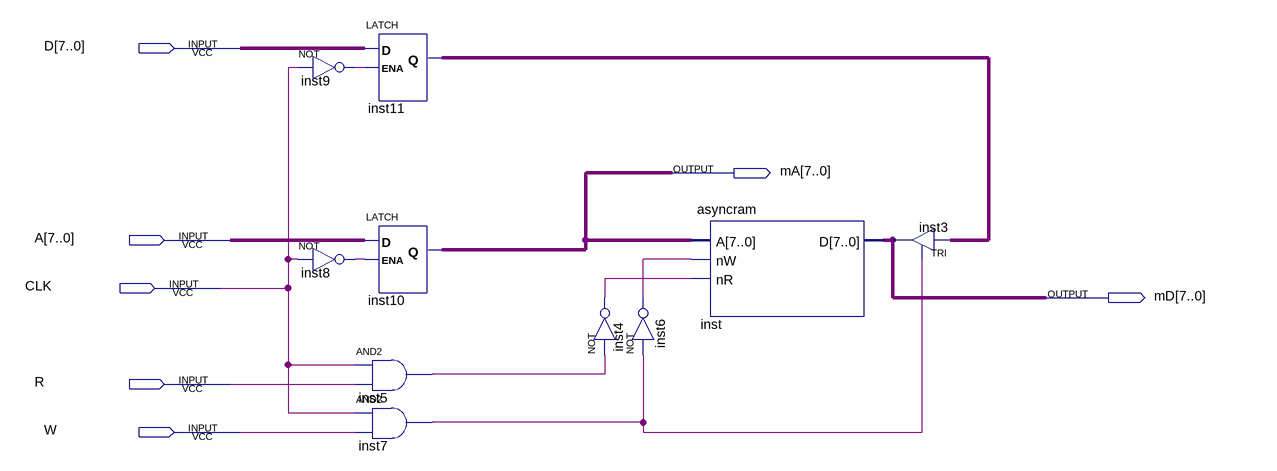
[diagram p0: schematic sheet]
// Quartus schematic memsys.bdf as structural Verilog: 10 symbols, 7 pins
module memsys (
  input  [7:0] D,
  input  [7:0] A,
  input  CLK,
  input  R,
  input  W,
  output [7:0] mA,
  output [7:0] mD
);

  wire inst4_out, inst5_out, inst6_out, inst7_out, inst8_out, inst9_out;
  wire [7:0] inst11_q;

  not inst9 (inst9_out, CLK);
  not inst8 (inst8_out, CLK);
  LATCH inst11[7:0] (.D(D), .ENA(inst9_out), .Q(inst11_q));
  LATCH inst10[7:0] (.D(A), .ENA(inst8_out), .Q(mA));
  and inst5 (inst5_out, CLK, R);
  and inst7 (inst7_out, CLK, W);
  not inst4 (inst4_out, inst5_out);
  asyncram inst (.A(mA), .nW(inst6_out), .nR(inst4_out), .D(mD));
  not inst6 (inst6_out, inst7_out);
  TRI inst3[7:0] (.IN(inst11_q), .OE(inst7_out), .OUT(mD));
endmodule
